# Altium schematic sheet [03] - POWER.SchDoc
size A3; DocumentNumber: 3; SheetNumber: 3; SheetTotal: 9
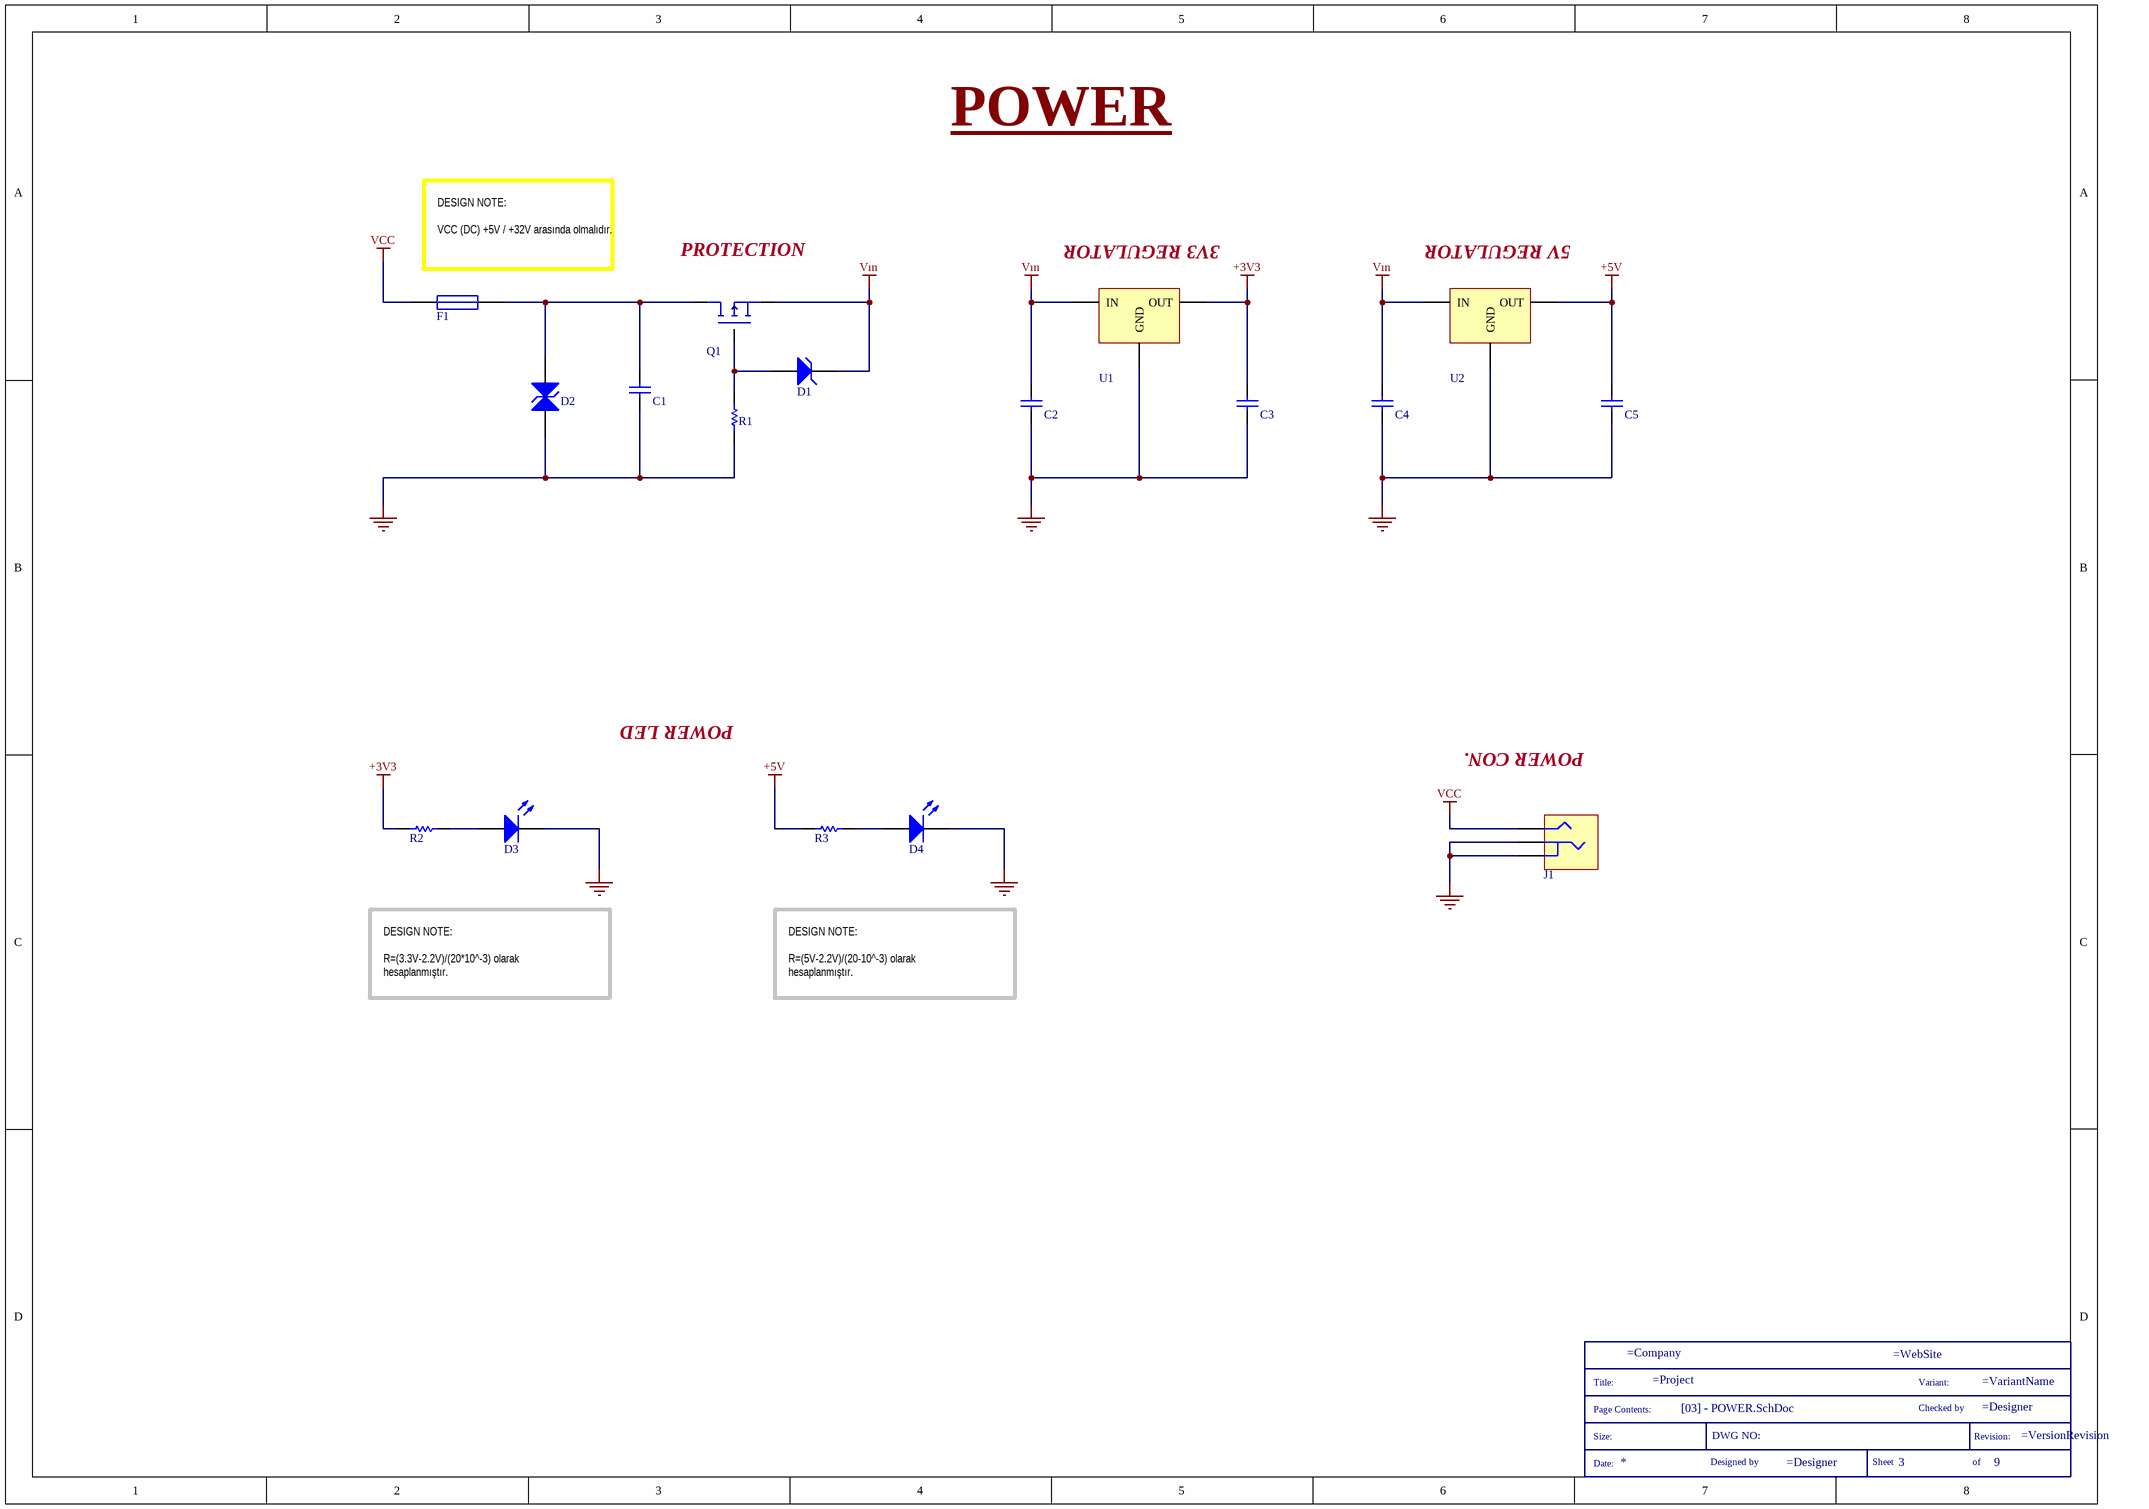
[diagram p0: [03] - POWER.SchDoc]

## Parts
*  SCH_TITLE  (value not drawn)  (graphical)
C1  1uF 35V  [C0603]  (value not drawn)
C2  100nF 35V  [CAP_CER_0603]  (value not drawn)
C3  10uF 16V  [CAP_CER_0805]  (value not drawn)
C4  100nF 35V  [CAP_CER_0603]  (value not drawn)
C5  10uF 16V  [CAP_CER_0805]  (value not drawn)
D1  12V 250mW  [SOT-23 (TO-236)]  (value not drawn)
D2  33V3  [DO-214AB]  (value not drawn)
D3  LED RED  [PLCC2]  (value not drawn)
D4  LED RED  [PLCC2]  (value not drawn)
F1  1.25A 32VDC  [FUSE_0603]  (value not drawn)
J1  CONN 2x5.5 Jack  [POWER_JACK]  (value not drawn)
Q1  PNP 60V 36A  [PowerPak-SO8]  (value not drawn)
R1  100K 1/4W  [RES_0603]  (value not drawn)
R2  54.9 1/8W  [RES_0805]  (value not drawn)
R3  140 1/8W  [RES_0805]  (value not drawn)
U1  TLE4284DV33  [PG-TO252-3-11]  (value not drawn)
U2  TLE4284DV50  [PG-TO252-3-11]  (value not drawn)

## Nets
+3V3: C3.2 R2.1 U1.2(OUT)
+5V: C5.2 R3.1 U2.2(OUT)
GND: C1.1 C2.1 C3.1 C4.1 C5.1 D2.1(A) D3.2(K) D4.2(K) J1.2 J1.3 R1.1 U1.1(GND) U2.1(GND)
VCC: F1.1 J1.1
Vın: C2.2 C4.2 D1.3(K) Q1.1(S) U1.3(IN) U2.3(IN)
NetC1_2: C1.2 D2.2(K) F1.2 Q1.5(D)
NetD1_2: D1.2(A) Q1.4(G) R1.2
NetD3_1: D3.1(A) R2.2
NetD4_1: D4.1(A) R3.2

## Notes on the sheet
- POWER
- (near U1) 3V3 REGULATOR
- (near U2) 5V REGULATOR
- (near F1) DESIGN NOTE:
  VCC (DC) +5V / +32V arasında olmalıdır.
- (near Q1) PROTECTION
- POWER LED
- POWER CON.
- DESIGN NOTE:
  R=(3.3V-2.2V)/(20*10^-3) olarak hesaplanmıştır.
- DESIGN NOTE:
  R=(5V-2.2V)/(20-10^-3) olarak hesaplanmıştır.
- (in symbol SCH_TITLE) Title:; Variant:; Page Contents:; Checked by; Size:; DWG NO:; Revision:; Date:; Designed by; Sheet; of

## Library data of the parts
* = SCH_TITLE: Schematic information
C1 = CGA3E3X5R1V105K080AB: CAP CER 1UF 35V; Manufacturer 1: TDK Corporation; Category: Ceramic Capacitors; Manufacture Part Number 1: CGA3E3X5R1V105K080AB; Case/Package: 0603 (1608 Metric); Quantity: 1; Supplier 1: Digikey; Supplier Part Number 1: 445-12484-1-ND; Supplier Order Qty 1: 1; Supplier Stock 1: 11910; Supplier Unit Price 1: 0,25; Supplier Currency 1: $
C2 C4 = GMK107BJ104KAHT: CAP CER 100nf 35V X5R 0603; Manufacturer 1: Taiyo Yuden; Category: Ceramic Capacitors; Manufacturer Part Number 1: GMK107BJ104KAHT; Case/Package: 0603 (1608 Metric); Quantity: 1; Supplier 1: Digikey; Supplier Part Number 1: 587-3357-1-ND; Supplier Order Qty 1: 1; Supplier Stock 1: 97932; Supplier Unit Price 1: 0,14; Supplier Currency 1: $
C3 C5 = CGA4J1X5R1C106M125AC: CAP CER 10UF 16V; Manufacturer 1: TDK Corporation; Category: Ceramic Capacitors; Manufacturer Part Number 1: CGA4J1X5R1C106M125AC; Case/Package: 0805 (2012 Metric); Quantity: 1; Supplier 1: Digikey; Supplier Part Number 1: 445-12654-1-ND; Supplier Order Qty 1: 1; Supplier Stock 1: 39905; Supplier Unit Price 1: 0,5; Supplier Currency 1: $
D1 = SZBZX84C12LT1G: DIODE ZENER 12V 250MW; Manufacturer 1: ON Semiconductor; Category: Diodes - Zener - Single; Manufacturer Part Number 1: SZBZX84C12LT1G; Case/Package: TO-236-3, SC-59, SOT-23-3; Quantity: 1; Supplier 1: Digikey; Supplier Part Number 1: SZBZX84C12LT1GOSCT-ND; Supplier Order Qty 1: 1; Supplier Stock 1: 80986; Supplier Unit Price 1: 0,15; Supplier Currency 1: $
D2 = SZP6SMB36CAT3G: TVS DIODE 30.8V 49.9V SMB; Manufacturer 1: Littelfuse Inc.; Category: TVS - Diodes; Manufacturer Part Number 1: SZP6SMB36CAT3G; Case/Package: DO-214AA, SMB; Quantity: 1; Supplier 1: Digikey; Supplier Part Number 1: SZP6SMB36CAT3GOSCT-ND; Supplier Order Qty 1: 1; Supplier Stock 1: 24611; Supplier Unit Price 1: 0,93; Supplier Currency 1: $
D3 D4 = LR T67D-U1V2-1-1-20-R18-Z: LED TOPLED RED 626NM 2PLCC; Manufacturer 1: OSRAM Opto Semiconductors Inc.; Category: LED Lighting - Color; Manufacturer Part Number 1: LR T67D-U1V2-1-1-20-R18-Z; Case/Package: 2-SMD, J-Lead; Quantity: 1; Supplier 1: Digikey; Supplier Part Number 1: 475-3762-1-ND; Supplier Order Qty 1: 1; Supplier Stock 1: 1905; Supplier Unit Price 1: 0,47; Supplier Currency 1: $
F1 = MFU0603FF01250P100: FUSE 1.25A 32VDC 0603; Manufacturer 1: Vishay Beyschlag; Category: Fuses; Manufacturer Part Number 1: MFU0603FF01250P100; Case/Package: 0603 (1608 Metric); Quantity: 1; Supplier 1: Digikey; Supplier Part Number 1: MFU06031.25CT-ND; Supplier Order Qty 1: 1; Supplier Stock 1: 24954; Supplier Unit Price 1: 0,31; Supplier Currency 1: $
J1 = PJ-002A: CONN PWR JACK 2X5.5MM SOLDER; Manufacturer 1: CUI Inc.; Category: Barrel - Power Connectors; Manufacturer Part Number 1: PJ-002A; Case/Package: Jack; Quantity: 1; Supplier 1: Digikey; Supplier Part Number 1: CP-002A-ND; Supplier Order Qty 1: 1; Supplier Stock 1: 115179; Supplier Unit Price 1: 0,6; Supplier Currency 1: $
Q1 = SQJ457EP-T1_GE3: MOSFET P-CH 60V 36A; Manufacturer 1: Vishay Siliconix; Category: Transistors - FETs, MOSFETs - Single; Manufacturer Part Number 1: SQJ457EP-T1_GE3; Case/Package: PowerPAK® SO-8; Quantity: 1; Supplier 1: Digikey; Supplier Part Number 1: SQJ457EP-T1_GE3CT-ND; Supplier Order Qty: 1; Supplier Stock 1: 24220; Supplier Unit Price 1: 0,92; Supplier Currency 1: $
R1 = ERJ-PA3J104V: RES SMD 100K 5% 1/4W 0603; Manufacturer 1: Panasonic Electronic Components; Category: Chip Resistor - Surface Mount; Manufacturer Part Number 1: ERJ-PA3J104V; Case/Package: 0603 (1608 Metric); Quantity: 1; Supplier 1: Digikey; Supplier Part Number 1: P100KBZCT-ND; Supplier Order Qty 1: 1; Supplier Stock 1: 11465; Supplier Unit Price 1: 0,11; Supplier Currency 1: $
R2 = ERJ-6ENF54R9V: RES SMD 54.9 OHM; Manufacturer 1: Panasonic Electronic Components; Category: Chip Resistor - Surface Mount; Manufacturer Part Number 1: ERJ-6ENF54R9V; Case/Package: 0805 (2012 Metric); Quantity: 1; Supplier 1: Digikey; Supplier Part Number 1: P54.9CCT-ND; Supplier Order Qty 1: 1; Supplier Stock 1: 43715; Supplier Unit Price 1: 0,1; Supplier Currency 1: $
R3 = ERJ-6ENF1400V: RES SMD 140 OHM 1% 1/8W 0805; Manufacturer 1: Panasonic Electronic Components; Category: Chip Resistor - Surface Mount; Manufacturer Part Number 1: ERJ-6ENF1400V; Case/Package: 0805 (2012 Metric); Quantity: 1; Supplier 1: Digikey; Supplier Part Number 1: P140CCT-ND; Supplier Order Qty 1: 1; Supplier Stock 1: 76818; Supplier Unit Price 1: 0,1; Supplier Currency 1: $
U1 = TLE4284DV33ATMA1: IC REG LINEAR 3.3V 1A; Manufacturer 1: Infineon Technologies; Category: PMIC - Voltage Regulators - Linear; Manufacturer Part Number 1: TLE4284DV33ATMA1; Case/Package: TO-252-3, DPak (2 Leads + Tab), SC-63; Quantity: 1; Supplier 1: Digikey; Supplier Part Number 1: TLE4284DV33ATMA1CT-ND; Supplier Order Qty 1: 1; Supplier Stock 1: 5062; Supplier Unit Price 1: 1,77; Supplier Currency 1: $
U2 = TLE4284DV50ATMA1: IC REG LINEAR 5V 1A; Manufacturer 1: Infineon Technologies; Category: PMIC - Voltage Regulators - Linear; Manufacturer Part Number 1: TLE4284DV50ATMA1; Case/Package: TO-252-3, DPak (2 Leads + Tab), SC-63; Quantity: 1; Supplier 1: Digikey; Supplier Part Number 1: TLE4284DV50ATMA1CT-ND; Supplier Order Qty 1: 1; Supplier Stock 1: 2563; Supplier Unit Price 1: 1,77; Supplier Currency 1: $